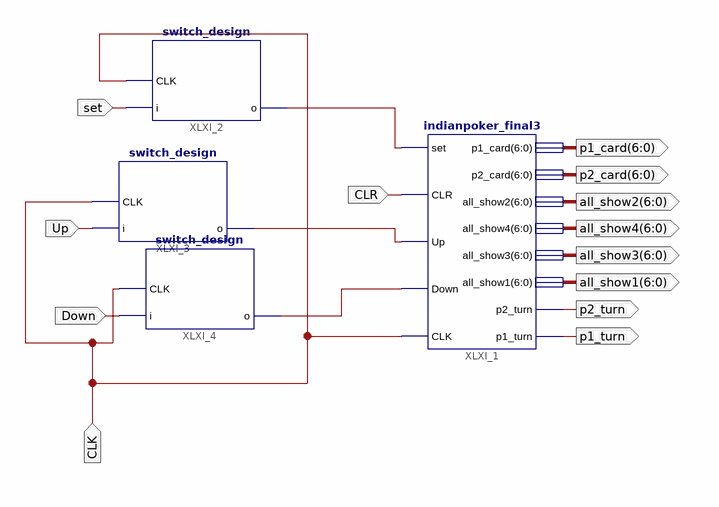
[diagram p0: schematic sheet 1]
// Xilinx ISE schematic indianpoker_real_final.sch (spartan3) as structural Verilog: 4 symbols, 13 ports
module indianpoker_real_final (
  input  CLK,
  input  Up,
  input  Down,
  input  CLR,
  input  set,
  output [6:0] p1_card,
  output [6:0] p2_card,
  output [6:0] all_show2,
  output [6:0] all_show4,
  output [6:0] all_show3,
  output [6:0] all_show1,
  output p2_turn,
  output p1_turn
);

  wire XLXN_1, XLXN_2, XLXN_3;

  indianpoker_final3 XLXI_1 (
    .set(XLXN_1), .CLR(CLR), .Up(XLXN_2), .Down(XLXN_3), .CLK(CLK), .p1_card(p1_card), .p2_card(p2_card),
    .all_show2(all_show2), .all_show4(all_show4), .all_show3(all_show3), .all_show1(all_show1),
    .p2_turn(p2_turn), .p1_turn(p1_turn));
  switch_design XLXI_2 (.CLK(CLK), .i(set), .o(XLXN_1));
  switch_design XLXI_3 (.CLK(CLK), .i(Up), .o(XLXN_2));
  switch_design XLXI_4 (.CLK(CLK), .i(Down), .o(XLXN_3));
endmodule
